# Altium schematic sheet DUE_Shield.SchDoc: Krapong-ROV, F-Tube (DUE)
size A4; DocumentNumber: 4; SheetNumber: 3; SheetTotal: 4; PageSetup: Record=PageOptions|CenterHorizontal=True|CenterVertical=True|PrintScale=0.97|XCorrection=1.00|YCorrection=1.00|PrintKind=0|BorderSize=5000000|LeftOffset=0|BottomOffset=0|Orientation=2|PaperLength=1000|PaperWidth=1000|Scale=100|PaperSource=7|PrintQuality=-3|MediaType=1|DitherType=10|PrintScaleMode=1|PaperKind=A4|PaperIndex=9
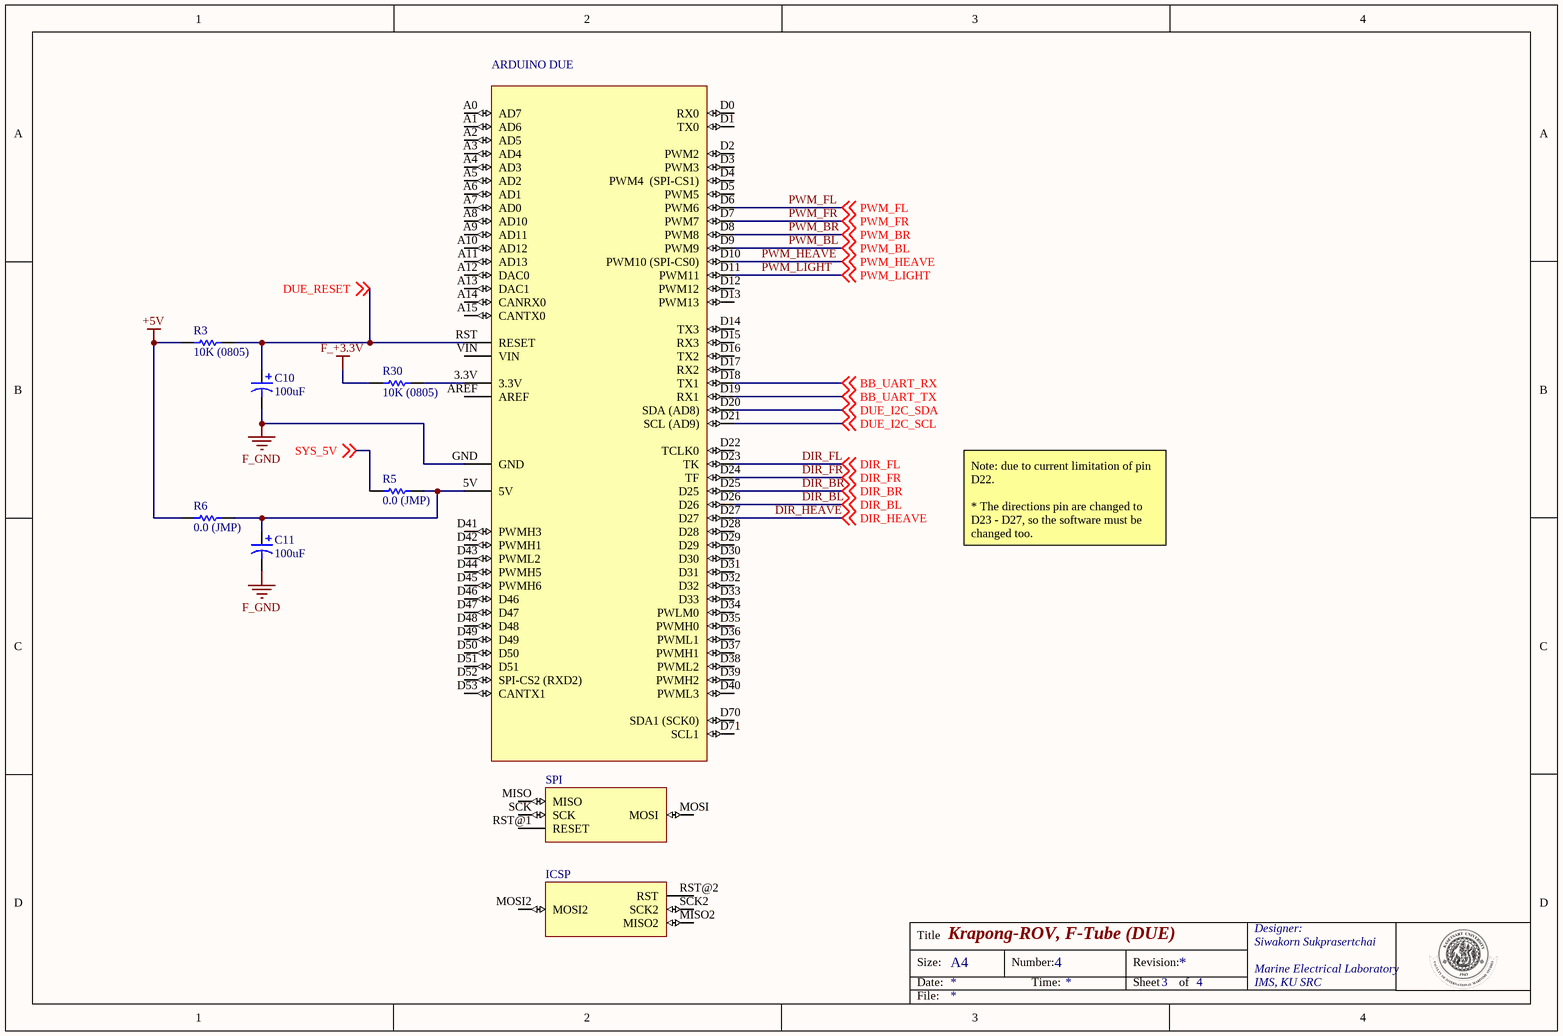
[diagram p0: DUE_Shield.SchDoc]

## Parts
C10  100uF  [PCB-ec5i0bi6g8n3i6bd77c9-1]
C11  100uF  [PCB-ibkib54e90xysjsqnert-1]
DUE  arduino due schematic and base pcb to top  [PCB-973053-1]  (value not drawn)
R3  10K (0805)  [RESC2013X60X40NL15T20]
R5  0.0 (JMP)  [RESC2013X60X35ML10T20]
R6  0.0 (JMP)  [RESC2013X60X35ML10T20]
R30  10K (0805)  [RESC2013X60X40NL15T20]

## Nets
+5V: R3.1 R6.1
F_+3.3V: R30.1
F_GND: C10.2 C11.2 DUE.GND
BB_UART_RX: DUE.D18(TX1) ; off-sheet BB_UART_RX
BB_UART_TX: DUE.D19(RX1) ; off-sheet BB_UART_TX
DIR_BL: DUE.D26 ; off-sheet DIR_BL
DIR_BR: DUE.D25 ; off-sheet DIR_BR
DIR_FL: DUE.D23(TK) ; off-sheet DIR_FL
DIR_FR: DUE.D24(TF) ; off-sheet DIR_FR
DIR_HEAVE: DUE.D27 ; off-sheet DIR_HEAVE
DUE_I2C_SCL: DUE.D21(SCL_(AD9)) ; off-sheet DUE_I2C_SCL
DUE_I2C_SDA: DUE.D20(SDA_(AD8)) ; off-sheet DUE_I2C_SDA
DUE_RESET: C10.1 DUE.RST(RESET) R3.2 ; off-sheet DUE_RESET
PWM_BL: DUE.D9(PWM9) ; off-sheet PWM_BL
PWM_BR: DUE.D8(PWM8) ; off-sheet PWM_BR
PWM_FL: DUE.D6(PWM6) ; off-sheet PWM_FL
PWM_FR: DUE.D7(PWM7) ; off-sheet PWM_FR
PWM_HEAVE: DUE.D10(PWM10_(SPI-CS0)) ; off-sheet PWM_HEAVE
PWM_LIGHT: DUE.D11(PWM11) ; off-sheet PWM_LIGHT
SYS_5V: R5.1 ; off-sheet SYS_5V
NetC11_1: C11.1 DUE.5V R5.2 R6.2
NetDUE_3.3V: DUE.3.3V R30.2

Not connected (* = marked no-connect by the designer): DUE A0(AD7) A1(AD6) A2(AD5) A3(AD4) A4(AD3) A5(AD2) A6(AD1) A7(AD0) A8(AD10) A9(AD11) A10(AD12) A11(AD13) A12(DAC0) A13(DAC1) A14(CANRX0) A15(CANTX0) AREF D0(RX0) D1(TX0) D2(PWM2) D3(PWM3) D4(PWM4__(SPI-CS1)) D5(PWM5) D12(PWM12) D13(PWM13) D14(TX3) D15(RX3) D16(TX2) D17(RX2) D22(TCLK0) D28 D29 D30 D31 D32 D33 D34(PWLM0) D35(PWMH0) D36(PWML1) D37(PWMH1) D38(PWML2) D39(PWMH2) D40(PWML3) D41(PWMH3) D42(PWMH1) D43(PWML2) D44(PWMH5) D45(PWMH6) D46 D47 D48 D49 D50 D51 D52(SPI-CS2_(RXD2)) D53(CANTX1) D70(SDA1_(SCK0)) D71(SCL1) MISO MISO2 MOSI MOSI2 RST@1(RESET) RST@2(RST) SCK SCK2 VIN

## Notes on the sheet
- Note: due to current limitation of pin D22.
  * The directions pin are changed to D23 - D27, so the software must be changed too.
- Title
- Size:
- Date:
- A4
- Number:
- Time:
- Revision:
- Sheet
- of
- Designer:
- Siwakorn Sukprasertchai
- Marine Electrical Laboratory
- IMS, KU SRC
- File:
- (in symbol CMP-973053-32) ARDUINO DUE; SPI; ICSP

## Library data of the parts
C10 = CMP-42da8bd37ecc9d1d-1: WX Series 100 uF 25 V ±20 % Surface Mount Chip Aluminum Electrolytic Capacitor; Manufacturer Part Number: UWX1E101MCL1GB; Voltage Rating (DC): 25.0 V; Lead-Free Status: Lead Free; Capacitance: 100 µF; Capacitance Tolerance: ±20%; Octopart URL: http://octopart.com/uwx1e101mcl1gb-nichicon-203120; Size-Length: 5.40 mm; Size-Height: 5.40 mm; RoHS: Compliant; Mounting Style: Surface Mount; Dielectric Material: Aluminum Electrolytic; Packaging: Tape & Reel (TR), Cut Tape (CT); Number of Pins: 2; Size-Diameter: 8.00 mm; OctopartID: 42da8bd37ecc9d1d
C11 = CMP-da8810cd3d6e054f-2: Capacitor Alum Elec, 10uf, 100v, 20%, Capacitor Alum Elec, 10uf, 100v, 20%, Smd, Full Reel; Manufacturer Part Number: EEE-2AA100UP; Lead-Free Status: Lead Free; Capacitance: 10.0 µF; REACH SVHC Compliance: No SVHC; Voltage Rating (DC): 100 V; Lifecycle Status: Not Listed by Manufacturer; RoHS: Compliant; Size-Height: 6.20 mm; Octopart URL: http://octopart.com/eee-2aa100up-panasonic-55558784; Size-Diameter: 8.00 mm; OctopartID: da8810cd3d6e054f; Packaging: Cut Tape (CT); Capacitance Tolerance: ±20%; Mounting Style: Surface Mount
DUE = CMP-973053-32: ARDUINO DUE schematic and base pcb; ADC Channels: YES; Supply Voltage-Nom (Vsup) (V): 5; Microcontroller Type: RISC MICROCONTROLLER; Clock/Crystal Freq-Max (fclk) (MHz): 16; CiivaID: 973053; Package Body Material: PLASTIC/EPOXY; DAC Channels: NO; Number of I/O Lines: 86; Bit Size: 8; Time@Peak Reflow Temperature-Max (s): 40; Supply Voltage-Max (Vsup) (V): 5.5; Supply Voltage-Min (Vsup) (V): 4.5; Additional Feature: OPERATES AT 2.7V MINIMUM SUPPLY @ 8 MHZ; ROM Programmability: FLASH; Width (mm): 14; Package Code: TFQFP; Technology: CMOS; Surface Mount: YES; Operating Temperature-Max (Cel): 85; Number of Terminals: 100; Terminal Position: QUAD; Moisture Sensitivity Level: 3; Lead Free: YES; Seated Height-Max (mm): 1.2; Terminal Finish: MATTE TIN; Temperature Grade: INDUSTRIAL; Peak Reflow Temperature (Cel): 260; External Data Bus Width: 8; Terminal Form: GULL WING; PWM Channels: YES; JESD-30 Code: S-PQFP-G100; Operating Temperature-Min (Cel): -40; JESD-97 Code: e3; Speed (MHz): 16; Package Shape: SQUARE; Address Bus Width (bits): 16; Package Style: FLATPACK, THIN PROFILE, FINE PITCH; DMA Channels: NO; Terminal Pitch (mm): 0.5; Length (mm): 14
R3 R30 = CMP-1860549-2: RES SMD 10K OHM 1% 1/3W 0805; Lead-Free Status: Lead Free; Power Rating: 0.125 W; Resistance: 10000.0 ?; Voltage Rating (DC): 150.0 V; Case/Package: 0805; Mounting Style: Surface Mount; Number of Pins: 2; Octopart Url: https://octopart.com/crcw080510k0fkeahp-vishay-42634554; OctopartID: fa6931e9523525ae; Packaging: Cut Tape (CT); REACH SVHC Compliance: No SVHC; Resistance Tolerance: ±1%; RoHS: Compliant
R5 R6 = CMP-1875921-8: Res Thick Film 0805 0 Ohm Molded SMD Paper T/R; Manufacturer Part Number: RC0805FR-070RL; Resistance: 0.0 ?; Lead-Free Status: Lead Free; Resistance Tolerance: ±1%; OctopartID: f3d13a5618eb2c16; Case/Package: 0805; Octopart Url: https://octopart.com/rc0805fr-070rl-yageo-9293404; Mounting Style: Surface Mount; RoHS: Compliant